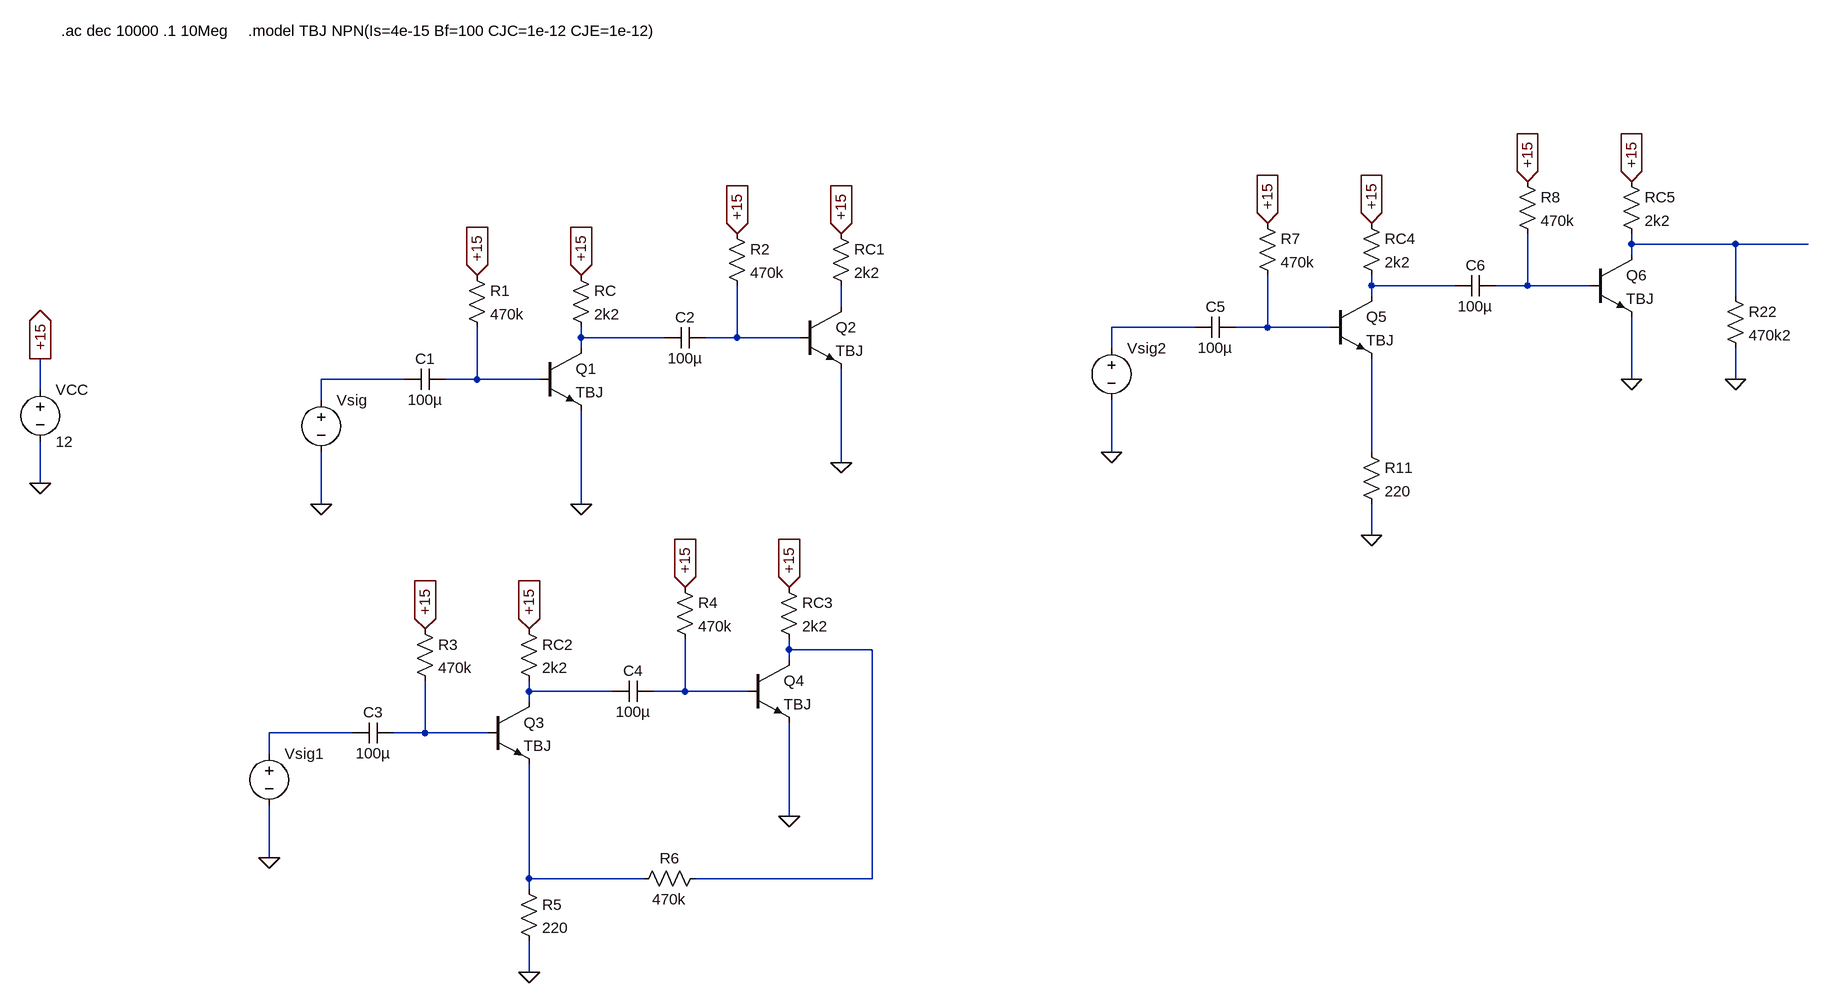
[diagram p0: schematic Realimentacao - Serie - Paralelo - TBJ - Emissor Comum.asc]
Realimentacao - Serie - Paralelo - TBJ - Emissor Comum.asc, the LTspice schematic file:
Version 4
SHEET 1 2308 1204
WIRE 2032 -96 2032 -112
WIRE 2192 -96 2032 -96
WIRE 2304 -96 2192 -96
WIRE 2032 -80 2032 -96
WIRE 1632 -32 1632 -48
WIRE 1760 -32 1632 -32
WIRE 1872 -32 1872 -112
WIRE 1872 -32 1824 -32
WIRE 1968 -32 1872 -32
WIRE 1632 -16 1632 -32
WIRE 2192 -16 2192 -96
WIRE 816 0 816 -32
WIRE 1360 32 1232 32
WIRE 1472 32 1472 -48
WIRE 1472 32 1424 32
WIRE 1568 32 1472 32
WIRE 416 48 416 32
WIRE 544 48 416 48
WIRE 656 48 656 -32
WIRE 656 48 608 48
WIRE 752 48 656 48
WIRE 416 64 416 48
WIRE 1232 64 1232 32
WIRE 144 112 16 112
WIRE 256 112 256 32
WIRE 256 112 208 112
WIRE 352 112 256 112
WIRE 2032 112 2032 16
WIRE 2192 112 2192 64
WIRE -416 128 -416 80
WIRE 16 144 16 112
WIRE 1232 224 1232 144
WIRE 1632 224 1632 80
WIRE 816 240 816 96
WIRE -416 272 -416 208
WIRE 16 304 16 224
WIRE 416 304 416 160
WIRE 1632 352 1632 304
WIRE 736 528 736 512
WIRE 864 528 736 528
WIRE 736 544 736 528
WIRE 336 592 336 576
WIRE 464 592 336 592
WIRE 576 592 576 512
WIRE 576 592 528 592
WIRE 672 592 576 592
WIRE 336 608 336 592
WIRE 64 656 -64 656
WIRE 176 656 176 576
WIRE 176 656 128 656
WIRE 272 656 176 656
WIRE -64 688 -64 656
WIRE 736 784 736 640
WIRE -64 848 -64 768
WIRE 336 880 336 704
WIRE 512 880 336 880
WIRE 864 880 864 528
WIRE 864 880 592 880
WIRE 336 896 336 880
WIRE 336 1024 336 976
FLAG 16 304 0
FLAG 416 304 0
FLAG -416 272 0
FLAG -416 80 +15
IOPIN -416 80 Out
FLAG 256 -48 +15
IOPIN 256 -48 In
FLAG 416 -48 +15
IOPIN 416 -48 In
FLAG 816 240 0
FLAG 656 -112 +15
IOPIN 656 -112 In
FLAG 816 -112 +15
IOPIN 816 -112 In
FLAG -64 848 0
FLAG 176 496 +15
IOPIN 176 496 In
FLAG 336 496 +15
IOPIN 336 496 In
FLAG 736 784 0
FLAG 576 432 +15
IOPIN 576 432 In
FLAG 736 432 +15
IOPIN 736 432 In
FLAG 336 1024 0
FLAG 1232 224 0
FLAG 1472 -128 +15
IOPIN 1472 -128 In
FLAG 1632 -128 +15
IOPIN 1632 -128 In
FLAG 1872 -192 +15
IOPIN 1872 -192 In
FLAG 2032 -192 +15
IOPIN 2032 -192 In
FLAG 2192 112 0
FLAG 1632 352 0
FLAG 2032 112 0
SYMBOL voltage 16 128 R0
WINDOW 3 17 116 Left 2
WINDOW 39 0 0 Left 0
SYMATTR Value ""
SYMATTR InstName Vsig
SYMATTR Value2 AC 1
SYMBOL cap 208 96 R90
WINDOW 0 0 32 VBottom 2
WINDOW 3 32 32 VTop 2
SYMATTR InstName C1
SYMATTR Value 100µ
SYMBOL npn 352 64 R0
SYMATTR InstName Q1
SYMATTR Value TBJ
SYMBOL res 240 -64 R0
SYMATTR InstName R1
SYMATTR Value 470k
SYMBOL res 400 -64 R0
SYMATTR InstName RC
SYMATTR Value 2k2
SYMBOL voltage -416 112 R0
WINDOW 123 0 0 Left 0
WINDOW 39 0 0 Left 0
SYMATTR InstName VCC
SYMATTR Value 12
SYMBOL npn 752 0 R0
SYMATTR InstName Q2
SYMATTR Value TBJ
SYMBOL res 640 -128 R0
SYMATTR InstName R2
SYMATTR Value 470k
SYMBOL res 800 -128 R0
SYMATTR InstName RC1
SYMATTR Value 2k2
SYMBOL cap 608 32 R90
WINDOW 0 0 32 VBottom 2
WINDOW 3 32 32 VTop 2
SYMATTR InstName C2
SYMATTR Value 100µ
SYMBOL voltage -64 672 R0
WINDOW 3 17 116 Left 2
WINDOW 39 0 0 Left 0
SYMATTR Value ""
SYMATTR InstName Vsig1
SYMATTR Value2 AC 1
SYMBOL cap 128 640 R90
WINDOW 0 0 32 VBottom 2
WINDOW 3 32 32 VTop 2
SYMATTR InstName C3
SYMATTR Value 100µ
SYMBOL npn 272 608 R0
SYMATTR InstName Q3
SYMATTR Value TBJ
SYMBOL res 160 480 R0
SYMATTR InstName R3
SYMATTR Value 470k
SYMBOL res 320 480 R0
SYMATTR InstName RC2
SYMATTR Value 2k2
SYMBOL npn 672 544 R0
SYMATTR InstName Q4
SYMATTR Value TBJ
SYMBOL res 560 416 R0
SYMATTR InstName R4
SYMATTR Value 470k
SYMBOL res 720 416 R0
SYMATTR InstName RC3
SYMATTR Value 2k2
SYMBOL cap 528 576 R90
WINDOW 0 0 32 VBottom 2
WINDOW 3 32 32 VTop 2
SYMATTR InstName C4
SYMATTR Value 100µ
SYMBOL res 320 880 R0
SYMATTR InstName R5
SYMATTR Value 220
SYMBOL res 608 864 R90
WINDOW 0 0 56 VBottom 2
WINDOW 3 32 56 VTop 2
SYMATTR InstName R6
SYMATTR Value 470k
SYMBOL voltage 1232 48 R0
WINDOW 3 17 116 Left 2
WINDOW 39 0 0 Left 0
SYMATTR Value ""
SYMATTR InstName Vsig2
SYMATTR Value2 AC 1
SYMBOL cap 1424 16 R90
WINDOW 0 0 32 VBottom 2
WINDOW 3 32 32 VTop 2
SYMATTR InstName C5
SYMATTR Value 100µ
SYMBOL npn 1568 -16 R0
SYMATTR InstName Q5
SYMATTR Value TBJ
SYMBOL res 1456 -144 R0
SYMATTR InstName R7
SYMATTR Value 470k
SYMBOL res 1616 -144 R0
SYMATTR InstName RC4
SYMATTR Value 2k2
SYMBOL npn 1968 -80 R0
SYMATTR InstName Q6
SYMATTR Value TBJ
SYMBOL res 1856 -208 R0
SYMATTR InstName R8
SYMATTR Value 470k
SYMBOL res 2016 -208 R0
SYMATTR InstName RC5
SYMATTR Value 2k2
SYMBOL cap 1824 -48 R90
WINDOW 0 0 32 VBottom 2
WINDOW 3 32 32 VTop 2
SYMATTR InstName C6
SYMATTR Value 100µ
SYMBOL res 1616 208 R0
SYMATTR InstName R11
SYMATTR Value 220
SYMBOL res 2176 -32 R0
SYMATTR InstName R22
SYMATTR Value 470k2
TEXT -96 -424 Left 2 !.model TBJ NPN(Is=4e-15 Bf=100 CJC=1e-12 CJE=1e-12)
TEXT -384 -424 Left 2 !.ac dec 10000 .1 10Meg

The netlist it stands for:
* Realimentacao - Serie - Paralelo - TBJ - Emissor Comum.asc
Vsig N009 0 AC 1
C1 N010 N009 100µ
Q1 N007 N010 0 0 TBJ
R1 +15 N010 470k
RC +15 N007 2k2
VCC +15 0 12
Q2 N004 N008 0 0 TBJ
R2 +15 N008 470k
RC1 +15 N004 2k2
C2 N008 N007 100µ
Vsig1 N015 0 AC 1
C3 N016 N015 100µ
Q3 N013 N016 N017 0 TBJ
R3 +15 N016 470k
RC2 +15 N013 2k2
Q4 N012 N014 0 0 TBJ
R4 +15 N014 470k
RC3 +15 N012 2k2
C4 N014 N013 100µ
R5 N017 0 220
R6 N012 N017 470k
Vsig2 N005 0 AC 1
C5 N006 N005 100µ
Q5 N002 N006 N011 0 TBJ
R7 +15 N006 470k
RC4 +15 N002 2k2
Q6 N001 N003 0 0 TBJ
R8 +15 N003 470k
RC5 +15 N001 2k2
C6 N003 N002 100µ
R11 N011 0 220
R22 N001 0 470k2
.model NPN NPN
.model PNP PNP
.lib standard.bjt
.model TBJ NPN(Is=4e-15 Bf=100 CJC=1e-12 CJE=1e-12)
.ac dec 10000 .1 10Meg
.backanno
.end